# EAGLE schematic Adafruit MicroUSB Lipo (EAGLE 9.3.0)
AUTHOR: K. TOWNSEND
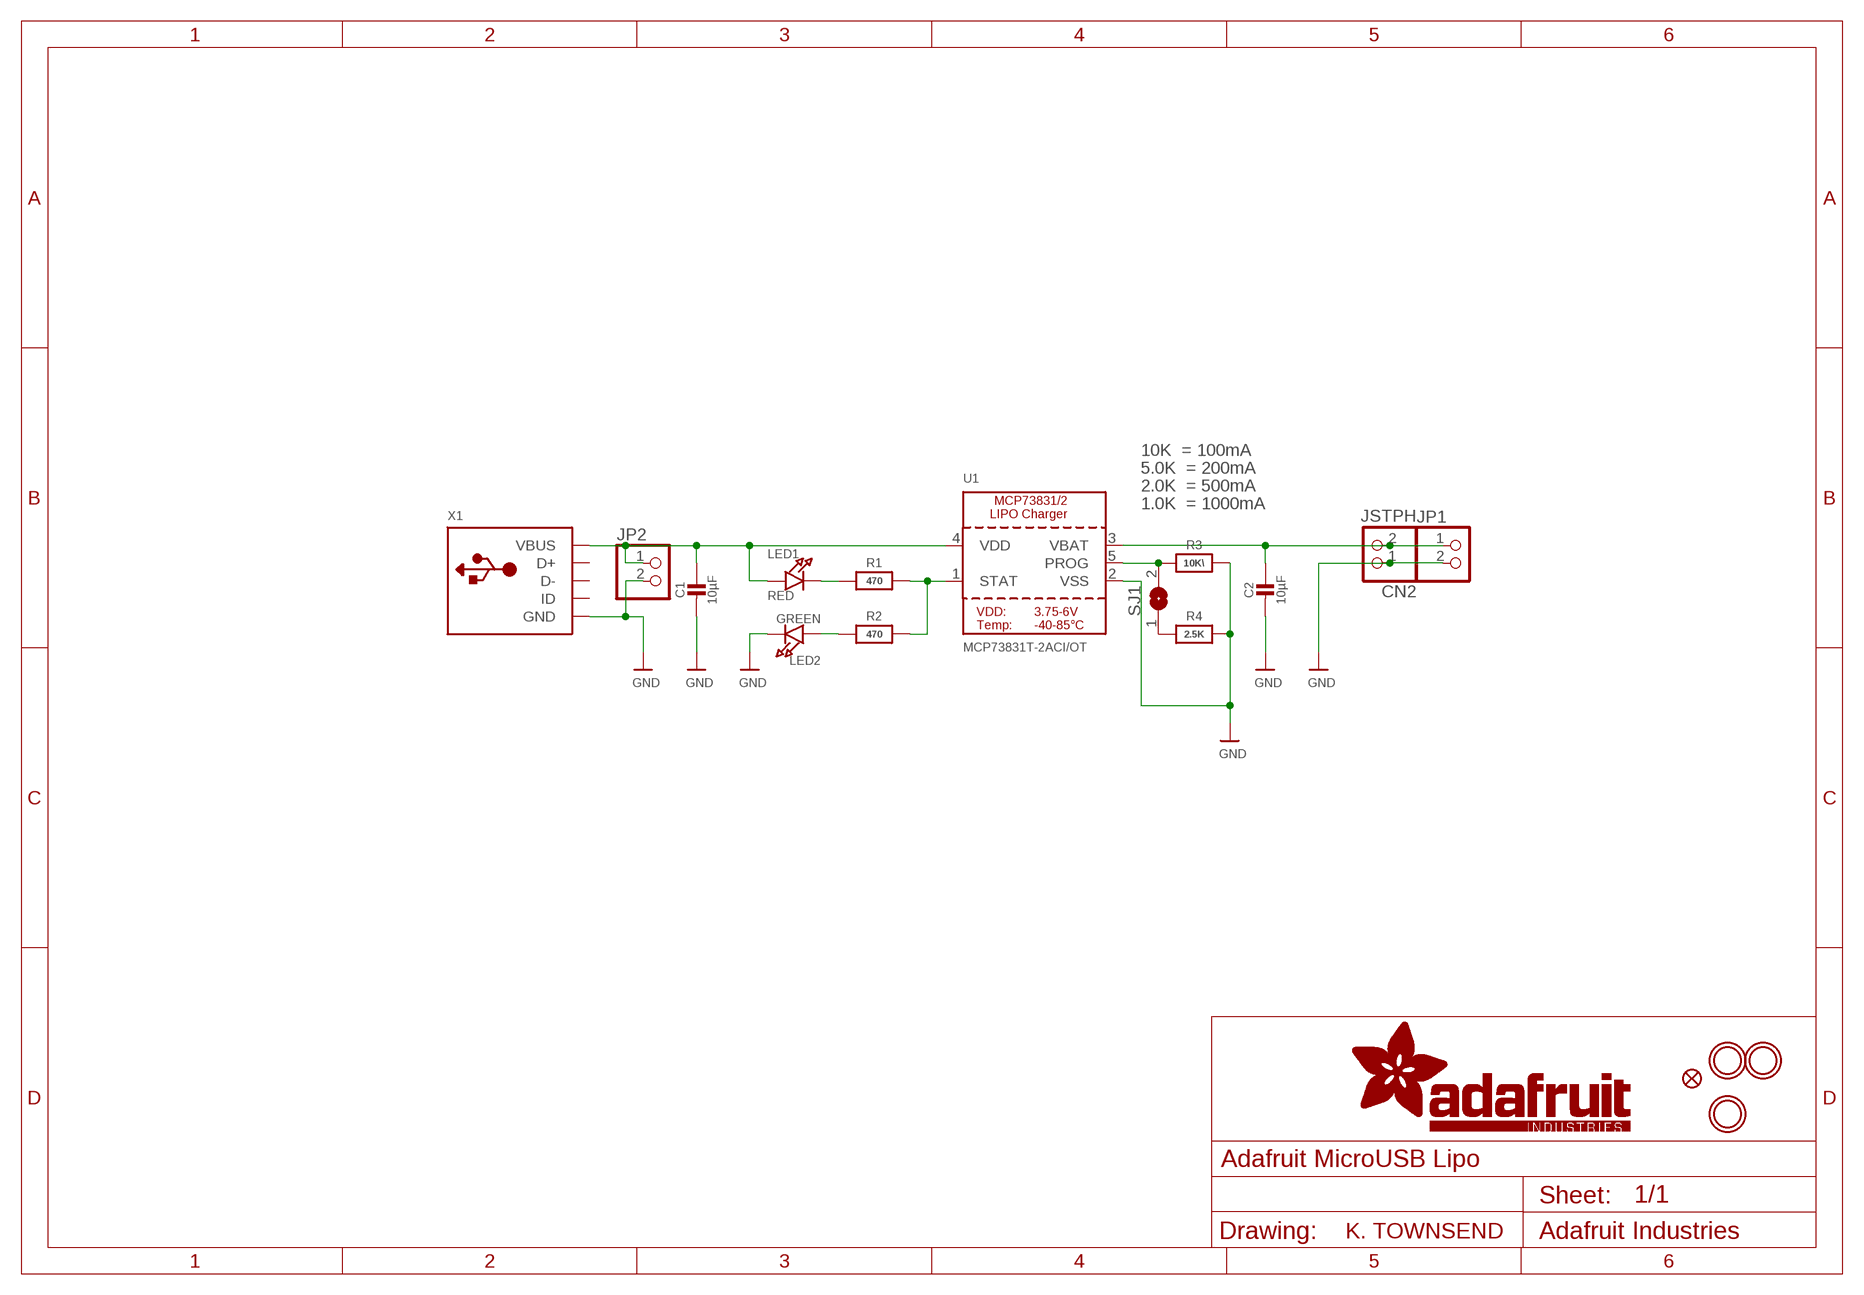
[diagram p0: schematic, sheet 1]

## Parts
C1  10µF  CAP_CERAMIC0805-NOOUTLINE  [0805-NO]
C2  10µF  CAP_CERAMIC0805-NOOUTLINE  [0805-NO]
CN2  JSTPH  JST_2PIN  [JSTPH2]
FID1  FIDUCIAL""  [FIDUCIAL_1MM]
JP1  HEADER-1X2ROUND  [1X02_ROUND]
JP2  HEADER-1X2ROUND  [1X02_ROUND]
LED1  RED  LED0805_NOOUTLINE  [CHIPLED_0805_NOOUTLINE]
LED2  GREEN  LED0805_NOOUTLINE  [CHIPLED_0805_NOOUTLINE]
R1  470  RESISTOR0805_NOOUTLINE  [0805-NO]
R2  470  RESISTOR0805_NOOUTLINE  [0805-NO]
R3  10K\  RESISTOR0805_NOOUTLINE  [0805-NO]
R4  2.5K  RESISTOR0805_NOOUTLINE  [0805-NO]
SJ1  SOLDERJUMPER  [SOLDERJUMPER_ARROW_NOPASTE]
U1  MCP73831T-2ACI/OT  MCP73831/2  [SOT23-5]
U$9  MOUNTINGHOLE2.5  [MOUNTINGHOLE_2.5_PLATED]
U$11  MOUNTINGHOLE2.5  [MOUNTINGHOLE_2.5_PLATED]
U$12  MOUNTINGHOLE2.5  [MOUNTINGHOLE_2.5_PLATED]
X1  USBMICRO_20329  [4UCONN_20329]

## Nets
GND: C1.2 C2.2 CN2.1 JP1.2 JP2.2 LED2.C R3.2 R4.2 U1.2(VSS) X1.BASE@1(GND) X1.BASE@2(GND) X1.GND X1.SPRT@1(GND) X1.SPRT@2(GND) X1.SPRT@3(GND) X1.SPRT@4(GND)
N$1: LED1.C R1.1
N$2: R1.2 R2.2 U1.1(STAT)
N$3: R4.1 SJ1.1
N$5: R3.1 SJ1.2 U1.5(PROG)
N$6: LED2.A R2.1
VBAT: C2.1 CN2.2 JP1.1 U1.3(VBAT)
VDD: C1.1 JP2.1 LED1.A U1.4(VDD) X1.VBUS
Unconnected: X1.D+ X1.D- X1.ID

## Notes on the sheet
- 10K  = 100mA
- 5.0K  = 200mA
- 2.0K  = 500mA
- 1.0K  = 1000mA

## Library data of the parts
C1 C2 = microbuilder:CAP_CERAMIC: Ceramic Capacitors For new designs, use the packages preceded by an '_' character since they are more reliable: The following footprints should be used on most boards: _0402 - Standard footprint for regular board layouts _0603 - Standard footprint for regular board layouts _0805 - Standard footprint for regular board layouts _1206 - Standard footprint for regular board layouts For extremely tight-pitch boards where space is at a premium, the following 'micro-pitch' footprints can be used (smaller pads, no silkscreen outline, etc.): _0402MP - Micro-pitch footprint for very dense/compact boards _0603MP - Micro-pitch footprint for very dense/compact boards _0805MP - Micro-pitch footprint for very dense/compact boards _1206MP - Micro-pitch footprint for very dense/compact boards
CN2 = microbuilder:JST_2PIN: JST 2-Pin Right-Angle Connector PH-Series - 4UConnector: 17311 SH-Series - 4UConnector: 07278
FID1 = microbuilder:FIDUCIAL: Fiducial Alignment Points Various fiducial points for machine vision alignment.; BOM: EXCLUDE
JP1 JP2 = microbuilder:HEADER-1X2: PIN HEADER
LED1 LED2 = microbuilder:LED: LED 0603 - 0603 Surface Mount Package 2mA: Green LED - Low Power (3.9mcd, 2ma, 1.7Vf) - Digikey: 475-2709-2-ND Orange LED - Low Power (9.8mcd, 2ma, 1.8Vf) - Digikey: 475-1194-2-ND Red LED - Low Power (5mcd, 2ma, 1.8Vf) - Digikey: 475-1195-2-ND Yellow LED - Low Power (7mcd, 2ma, 1.8Vf) - Digikey: 475-1196-2-ND 5mA: Blue LED - Low Power (17mcd, 5ma, 2.9Vf) - Digikey: LNJ937W8CRACT-ND 0805 - 0805 Surface Mount Package 2mA: Red LED (8.8mcd, 2mA, 1.8Vf, Clear) - Low Power [Digikey: 475-2510-1-ND] Green LED (5mcd, 2mA, 1.8Vf, Clear) - Low Power [Digikey: 475-2730-1-ND] Yellow LED (11.3mcd, 2mA, 1.8Vf, Clear) - Low Power [Digikey: 475-2555-1-ND] 20mA: Red LED (104mcd, 20mA, Diffused) - LS R976 [Digikey: 475-1278-6-ND] Red LED (12mcd, 20mA, 2.0Vf, Clear) - APT2012EC [Digikey: 754-1128-1-ND] Green LED (15mcd, 20mA, 2.2Vf, Clear) - APT2012GC [Digikey: 754-1131-1-ND] Orange LED (160mcd, 20mA, 2.1Vf, Clear) - APT2012SECK [Digikey: 754-1130-1-ND] 1206 - 1206 Surface Mount Package Green LED (26mcd, 20mA, Diffused) - LG N971 [Digikey: 475-1407-6-ND] Red LED (15mcd, 20mA, Diffused) - LH N974 [Digikey: 475-1416-6-ND] Cree - Cree High-Power Surface Mount LEDs XPEBWT-L1-0000-00D50 - White 111lm 350mA 2.9Vf 6200K 110° XTEAWT-00-0000-00000LEE3 - White 114lm 350mA 2.85Vf 5000K 115° Everlight - Everlight 45-21 Series Surface Mount LEDs 45-21/QK2C-B2832AC2CB2/2T - Warm White 2000mcd 20mA 3.25Vf 3050K 120° 45-21/LK2C-B38452C4CB2/2T - Nuetral White 2000mcd 20mA 3.25Vf 4150K 120° 45-21/LK2C-B50634C6CB2/2T - Cold White 2200mcd 20mA 3.25Vf 5650K 120° PLCC2 Reverse Mount LS T77K-J1L2-1-0-2-R18-Z - Red 11.25mcd 2mA 1.8Vf 630nm 120° LO T77K-L1M2-24-Z - Orange 19.6mcd 2mA 1.8Vf 606nm 120° LY T77K-K2M1-26-Z - Yellow 15.7mcd 2mA 1.8Vf 587nm 120°
R1-R4 = microbuilder:RESISTOR: Resistors For new designs, use the packages preceded by an '_' character since they are more reliable: The following footprints should be used on most boards: _0402 - Standard footprint for regular board layouts _0603 - Standard footprint for regular board layouts _0805 - Standard footprint for regular board layouts _1206 - Standard footprint for regular board layouts For extremely tight-pitch boards where space is at a premium, the following 'micro-pitch' footprints can be used (smaller pads, no silkscreen outline, etc.): _0402MP - Micro-pitch footprint for very dense/compact boards _0603MP - Micro-pitch footprint for very dense/compact boards _0805MP - Micro-pitch footprint for very dense/compact boards _1206MP - Micro-pitch footprint for very dense/compact boards
SJ1 = microbuilder:SOLDERJUMPER: SMD Solder JUMPER Solder the two pads together to create a connection, or remove the solder to break it. REFLOW - Use this footprint for solder paste and reflow ovens. WAVE - Use this footprint for hand-soldering (larger pads). CLOSED - Has a trace between the two pads to ensure it is closed by default. The trace needs to be cut to disable the jumper, and can be closed again by creating a solder bridge between the two pads.; BOM: EXCLUDE
U1 = microbuilder:MCP73831/2: MCP73831/2 LIPO Charger VDD: 3.75 - 6V Temp -40 - 85°C Programmable Charge Rate: 15-500mA NOTE: STAT is a tri-state logic output on the MCP73831 and an open-drain output on the MCP73832. SOT23-5 with 4.2V output and tri-state logic on STAT = MCP73831T-2ACI/OT
U$9 U$11 U$12 = microbuilder:MOUNTINGHOLE: Mounting Hole For #2 screws (0.086"/2.18mm width, 0.094"/2.4mm hole) use 2.5mm; BOM: EXCLUDE
X1 = microbuilder:USB: USB Connectors USBMINIB - Surface Mount Female Mini-B USB Connector 4UConnector: 06564